# Altium schematic sheet High Current LED Driver.SchDoc: High Current Driver
size A4; SheetNumber: 3; SheetTotal: 6
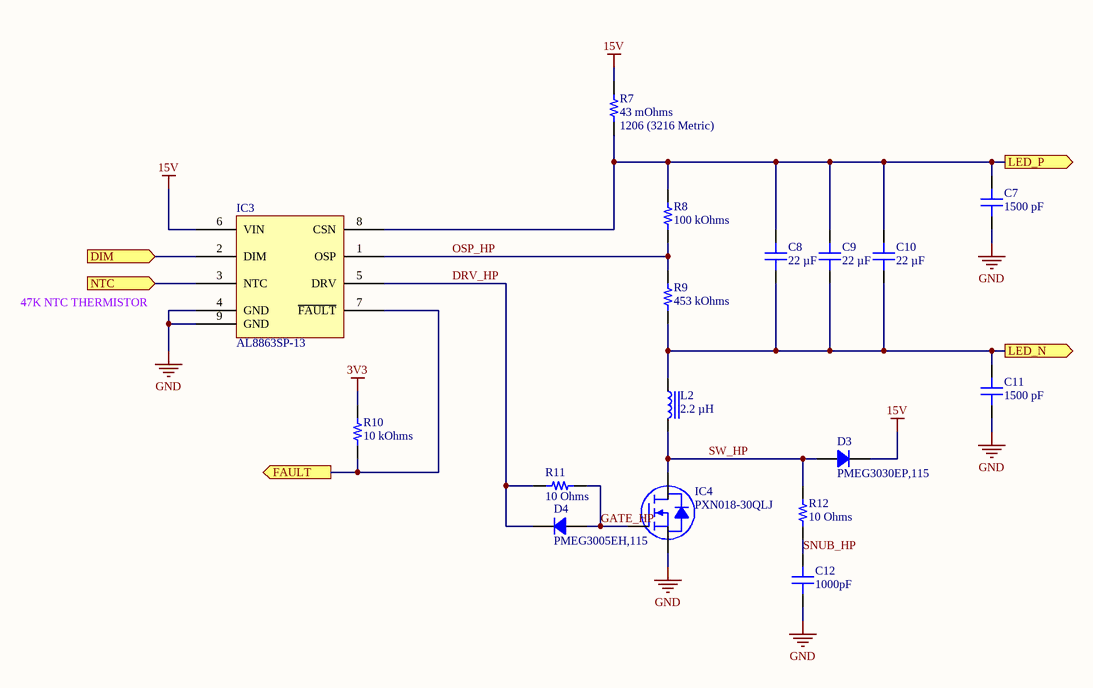
[diagram p0: High Current LED Driver.SchDoc]

## Parts
C7  1500 pF  [CAP 0603_1608]
C8  22 µF  [CAP 1210_3225 - 1MM]
C9  22 µF  [CAP 1210_3225 - 1MM]
C10  22 µF  [CAP 1210_3225 - 1MM]
C11  1500 pF  [CAP 0603_1608]
C12  1000pF  [CAP 0603_1608]
D3  PMEG3030EP,115  [NEXPERIA SOD-128 CFP5]
D4  PMEG3005EH,115  [SOD123F]
IC3  AL8863SP-13  [DIODES INC SO-8EP]
IC4  PXN018-30QLJ  [NEXPERIA MLPAK33 SOT8002-1]
L2  2.2 µH  [TAIYO YUDEN NRS8030]
R7  43 mOhms  Package / Case: 1206 (3216 Metric)  [STACKPOLE CSR1206]
R8  100 kOhms  [RES 0603_1608]
R9  453 kOhms  [RES 0603_1608]
R10  10 kOhms  [RES 0603_1608]
R11  10 Ohms  [RES 0805_2012]
R12  10 Ohms  [RES 0805_2012]

## Ports
DIM (in), FAULT (out), LED_N (out), LED_P (out), NTC (in)

## Nets
3V3: R10.2
15V: D3.2 IC3.6(VIN) R7.2
GND: C7.1 C11.1 C12.1 IC3.4(GND) IC3.9(GND) IC4.S
DIM: IC3.2(DIM) ; port DIM
DRV_HP: D4.2 IC3.5(DRV) R11.1
FAULT: IC3.7(~{FAULT}) R10.1 ; port FAULT
GATE_HP: D4.1 IC4.G R11.2
LED_N: C8.1 C9.1 C10.1 C11.2 L2.2 R9.1 ; port LED_N
LED_P: C7.2 C8.2 C9.2 C10.2 IC3.8(CSN) R7.1 R8.2 ; port LED_P
NTC: IC3.3(NTC) ; port NTC
OSP_HP: IC3.1(OSP) R8.1 R9.2
SNUB_HP: C12.2 R12.1
SW_HP: D3.1 IC4.D L2.1 R12.2

## Notes on the sheet
- 47K NTC THERMISTOR
- Title
- Size:
- Date:
- A4
- Number:
- Time:
- Revision:
- Sheet
- of
- File:

## Library data of the parts
C7 C11 = 0603N152J500CT: CAP CER 1500PF 50V C0G/NP0 0603; manufacturer: Walsin Technology Corporation; Temperature Coefficient: C0G, NP0; Tolerance: ±5%; Part Number: 0603N152J500CT; Value: 1500 pF; Applications: General Purpose; Capacitance: 1500 pF; componentlink1description: Datasheet; componentlink1url: http://www.passivecomponent.com/wp-content/uploads/2018/10/MLCC.pdf; componentlink2description: DigiKey Link; componentlink2url: https://www.digikey.com/en/products/detail/walsin-technology-corporation/0603N152J500CT/9354986; Device Package: 0603 (1608 Metric); lastupdated: 16/03/2022 06:22:23; Lifecycle Status: Active; Minimum Order: 1; Mounting Type: Surface Mount, MLCC; Operating Temperature: -55°C ~ 125°C; Package / Case: 0603 (1608 Metric); packaging: TapeAndReel; partid: 13065; Part Status: Active; price: 0.01; series: -; Size / Dimension: 0.063" L x 0.031" W (1.60mm x 0.80mm); Supplier 1: DigiKey; Supplier Part Number 1: 1292-1489-1-ND; Thickness (Max): 0.037" (0.95mm); Voltage - Rated: 50V
C8-C10 = CL32A226KAJNNNE: CAP CER 22UF 25V X5R 1210; manufacturer: Samsung Electro-Mechanics; Tolerance: ±10%; Part Number: CL32A226KAJNNNE; Value: 22 µF; Applications: General Purpose; Capacitance: 22 µF; componentlink1description: Datasheet; componentlink1url: http://www.samsungsem.com/kr/support/product-search/mlcc/CL32A226KAJNNNE.jsp; componentlink2description: DigiKey Link; componentlink2url: https://www.digikey.com/en/products/detail/samsung-electro-mechanics/CL32A226KAJNNNE/3886759; Device Package: 1210 (3225 Metric); lastupdated: 16/03/2022 06:41:57; Lifecycle Status: Active; Minimum Order: 1; Mounting Type: Surface Mount, MLCC; Operating Temperature: -55°C ~ 85°C; Package / Case: 1210 (3225 Metric); packaging: TapeAndReel; partid: 39435; Part Status: Active; price: 0.11; series: CL; Size / Dimension: 0.126" L x 0.098" W (3.20mm x 2.50mm); Supplier 1: DigiKey; Supplier Part Number 1: 1276-1101-1-ND; Temperature Coefficient: X5R; Thickness (Max): 0.106" (2.70mm); Voltage - Rated: 25V
C12 = 06035C102KAT2A: CAP CER 1000PF 50V X7R 0603; manufacturer: AVX Corporation; Tolerance: ±10%; Part Number: 06035C102KAT2A; Value: 1000pF; Applications: General Purpose; Capacitance: 1000pF; componentlink1description: Datasheet; componentlink1url: http://datasheets.avx.com/X7RDielectric.pdf; componentlink2description: DigiKey Link; componentlink2url: http://digikey.com/product-detail/en/avx-corporation/06035C102KAT2A/478-1215-1-ND/564247; Device Package: 0603 (1608 Metric); lastupdated: 02/09/2020 01:03:30; Lifecycle Status: Active; Minimum Order: 1; Mounting Type: Surface Mount, MLCC; Operating Temperature: -55°C ~ 125°C; Package / Case: 0603 (1608 Metric); packaging: TapeAndReel; partid: 5544; Part Status: Active; price: 0.01; series: -; Size / Dimension: 0.063" L x 0.032" W (1.60mm x 0.81mm); Supplier 1: DigiKey; Supplier Part Number 1: 478-1215-1-ND; Temperature Coefficient: X7R; Thickness (Max): 0.035" (0.90mm); Voltage - Rated: 50V
D3 = PMEG3030EP,115: DIODE SCHOTTKY 30V 3A CFP5; Manufacturer: Nexperia USA Inc.; Capacitance @ Vr, F: 470pF @ 1V, 1MHz; Current - Reverse Leakage @ Vr: 5 mA @ 30 V; Speed: Fast Recovery =< 500ns, > 200mA (Io); Voltage - Forward (Vf) (Max) @ If: 360 mV @ 3 A; Part Number: PMEG3030EP,115; ComponentLink1Description: Datasheet; ComponentLink1URL: https://assets.nexperia.com/documents/data-sheet/PMEG3030EP.pdf; ComponentLink2Description: DigiKey Link; ComponentLink2URL: https://www.digikey.com/en/products/detail/nexperia-usa-inc/PMEG3030EP-115/2228693; Current - Average Rectified (Io): 3A; Diode Type: Schottky; LastUpdated: 16/03/2022 11:28:51; Lifecycle Status: Active; Minimum Order: 1; Mounting Type: Surface Mount; Operating Temperature - Junction: 150°C (Max); Package / Case: SOD-128; Packaging: TapeAndReel; PartId: 3379; Part Status: Active; Price: 0.16; Series: -; Supplier 1: DigiKey; Supplier Part Number 1: 1727-5324-1-ND; Supplier Device Package: SOD-128/CFP5; Voltage - DC Reverse (Vr) (Max): 30 V
D4 = PMEG3005EH,115: DIODE SCHOTTKY 30V 500MA SOD123F; Manufacturer: Nexperia USA Inc.; Capacitance @ Vr, F: 70pF @ 1V, 1MHz; Current - Average Rectified (Io): 500mA (DC); Current - Reverse Leakage @ Vr: 150 µA @ 30 V; Speed: Fast Recovery =< 500ns, > 200mA (Io); Voltage - Forward (Vf) (Max) @ If: 430 mV @ 500 mA; Part Number: PMEG3005EH,115; ComponentLink1Description: Datasheet; ComponentLink1URL: https://assets.nexperia.com/documents/data-sheet/PMEGXX05EH_EJ_SER.pdf; ComponentLink2Description: DigiKey Link; ComponentLink2URL: https://www.digikey.com/en/products/detail/nexperia-usa-inc/PMEG3005EH-115/1157689; Diode Type: Schottky; LastUpdated: 16/03/2022 07:00:41; Lifecycle Status: Active; Minimum Order: 1; Mounting Type: Surface Mount; Operating Temperature - Junction: 150°C (Max); Package / Case: SOD-123F; Packaging: TapeAndReel; PartId: 2471; Part Status: Active; Price: 0.05; Series: -; Supplier 1: DigiKey; Supplier Part Number 1: 1727-3865-1-ND; Supplier Device Package: SOD-123F; Voltage - DC Reverse (Vr) (Max): 30 V
IC3 = AL8863SP-13: LED MV INT SWITCH SO-8EP; Manufacturer: Diodes Incorporated; Dimming: PWM; Frequency: 50kHz ~ 1MHz; Internal Switch(s): No; Number of Outputs: 1; Topology: Step-Down (Buck); Voltage - Supply (Max): 60V; Voltage - Supply (Min): 4.5V; Part Number: AL8863SP-13; Applications: Commercial & Industrial Lighting; ComponentLink1Description: Datasheet; ComponentLink1URL: https://www.diodes.com/assets/Datasheets/AL8863.pdf; ComponentLink2Description: DigiKey Link; ComponentLink2URL: https://www.digikey.com/en/products/detail/diodes-incorporated/AL8863SP-13/10481155; LastUpdated: 16/03/2022 13:00:06; Lifecycle Status: Active; Minimum Order: 1; Mounting Type: Surface Mount; Operating Temperature: -40°C ~ 125°C (TA); Package / Case: 8-SOIC (0.154", 3.90mm Width) Exposed Pad; Packaging: TapeAndReel; PartId: 9; Part Status: Active; Price: 0.23; Series: -; Supplier 1: DigiKey; Supplier Part Number 1: 31-AL8863SP-13CT-ND; Supplier Device Package: 8-SO-EP; Type: DC DC Controller
IC4 = PXN018-30QLJ: PXN018-30QL/SOT8002/MLPAK33; Manufacturer: Nexperia USA Inc.; Current - Continuous Drain (Id) @ 25°C: 7.5A (Ta), 19.2A (Tc); Drain to Source Voltage (Vdss): 30 V; Drive Voltage (Max Rds On,  Min Rds On): 4.5V, 10V; FET Type: N-Channel; Gate Charge (Qg) (Max) @ Vgs: 10.8 nC @ 10 V; Input Capacitance (Ciss) (Max) @ Vds: 447 pF @ 15 V; Power Dissipation (Max): 1.7W (Ta), 10.9W (Tc); Rds On (Max) @ Id, Vgs: 18mOhm @ 7.5A, 10V; Vgs (Max): ±20V; Vgs(th) (Max) @ Id: 2.5V @ 250µA; Part Number: PXN018-30QLJ; ComponentLink1Description: Datasheet; ComponentLink1URL: https://assets.nexperia.com/documents/data-sheet/PXN018-30QL.pdf; ComponentLink2Description: DigiKey Link; ComponentLink2URL: https://www.digikey.com/en/products/detail/nexperia-usa-inc/PXN018-30QLJ/13690066; LastUpdated: 16/03/2022 13:32:54; Lifecycle Status: Active; Minimum Order: 1; Mounting Type: Surface Mount; Operating Temperature: -55°C ~ 150°C (TJ); Packaging: TapeAndReel; Part Status: Active; Price: 0.18; Series: -; Supplier 1: DigiKey; Supplier Part Number 1: 1727-PXN018-30QLJCT-ND; Supplier Device Package: MLPAK33; Technology: MOSFET (Metal Oxide)
L2 = NRS8030T2R2NJGJ: FIXED IND 2.2UH 4.8A 19.5MOHM SM; Manufacturer: Taiyo Yuden; Current - Saturation: 4.9A; DC Resistance (DCR): 19.5mOhm Max; Frequency - Self Resonant: 60MHz; Inductance Frequency - Test: 100 kHz; Material - Core: Ferrite; Shielding: Shielded; Tolerance: ±30%; Type: Wirewound; Part Number: NRS8030T2R2NJGJ; ComponentLink1Description: Datasheet; ComponentLink1URL: https://www.yuden.co.jp/productdata/catalog/wound04_e.pdf; ComponentLink2Description: DigiKey Link; ComponentLink2URL: https://www.digikey.com/en/products/detail/taiyo-yuden/NRS8030T2R2NJGJ/2666003; Current Rating (Amps): 4.8 A; Device Package: Nonstandard; Height - Seated (Max): 0.118" (3.00mm); Inductance: 2.2 µH; LastUpdated: 16/03/2022 13:29:46; Lifecycle Status: Active; Minimum Order: 1; Mounting Type: Surface Mount; Operating Temperature: -25°C ~ 125°C; Package / Case: Nonstandard; Packaging: TapeAndReel; PartId: 5494; Part Status: Active; Price: 0.21; Series: NR, S Type; Size / Dimension: 0.315" L x 0.315" W (8.00mm x 8.00mm); Supplier 1: DigiKey; Supplier Part Number 1: 587-2965-1-ND; Value: 2.2 µH
R7 = RLP73M2BR043JTD: RES 0.043 OHM 5% 1/2W 1206; Manufacturer: TE Connectivity Passive Product; Power (Watts): 0.5W, 1/2W; Temperature Coefficient: ±400ppm/°C; Part Number: RLP73M2BR043JTD; ComponentLink1Description: Datasheet; ComponentLink1URL: https://www.te.com/commerce/DocumentDelivery/DDEController?Action=srchrtrv&DocNm=1773269&DocType=DS&DocLang=English; ComponentLink2Description: DigiKey Link; ComponentLink2URL: https://www.digikey.com/en/products/detail/te-connectivity-passive-product/RLP73M2BR043JTD/4032208; Composition: Thick Film; Device Package: 1206 (3216 Metric); Features: Current Sense; Height - Seated (Max): 0.026" (0.65mm); LastUpdated: 16/03/2022 06:57:55; Lifecycle Status: Active; Minimum Order: 1; Number of Terminations: 2; Operating Temperature: -55°C ~ 155°C; Packaging: TapeAndReel; PartId: 2125; Part Status: Active; Price: 0.10; Resistance: 43 mOhms; Series: RL73, CGS; Size / Dimension: 0.122" L x 0.061" W (3.10mm x 1.55mm); Supplier 1: DigiKey; Supplier Part Number 1: A109833CT-ND; Supplier Device Package: 1206; Tolerance: ±5%; Value: 43 mOhms
R8 = CRCW0603100KFKEAC: RES 100K OHM 1% 1/10W 0603; Manufacturer: Vishay Dale; Power (Watts): 0.1W, 1/10W; Temperature Coefficient: ±100ppm/°C; Part Number: CRCW0603100KFKEAC; Value: 100 kOhms; ComponentLink1Description: Datasheet; ComponentLink1URL: http://www.vishay.com/docs/28773/crcwce3.pdf; ComponentLink2Description: DigiKey Link; ComponentLink2URL: https://www.digikey.com/en/products/detail/vishay-dale/CRCW0603100KFKEAC/7928372; Composition: Thick Film; Device Package: 0603 (1608 Metric); Height - Seated (Max): 0.022" (0.55mm); LastUpdated: 16/03/2022 06:41:03; Lifecycle Status: Active; Minimum Order: 1; Number of Terminations: 2; Operating Temperature: -55°C ~ 155°C; Package / Case: 0603 (1608 Metric); Packaging: CutTape; PartId: 12549; Part Status: Active; Price: 0.01; Resistance: 100 kOhms; Series: CRCW-C; Supplier 1: DigiKey; Supplier Part Number 1: 541-3950-1-ND; Supplier Device Package: 0603; Tolerance: ±1%
R9 = RMCF0603FT453K: RES 453K OHM 1% 1/10W 0603; Manufacturer: Stackpole Electronics Inc; Power (Watts): 0.1W, 1/10W; Temperature Coefficient: ±100ppm/°C; Part Number: RMCF0603FT453K; Value: 453 kOhms; ComponentLink1Description: Datasheet; ComponentLink1URL: https://www.seielect.com/catalog/sei-rmcf_rmcp.pdf; ComponentLink2Description: DigiKey Link; ComponentLink2URL: https://www.digikey.com/en/products/detail/stackpole-electronics-inc/RMCF0603FT453K/1761122; Composition: Thick Film; Device Package: 0603 (1608 Metric); Features: Automotive AEC-Q200; Height - Seated (Max): 0.022" (0.55mm); LastUpdated: 16/03/2022 06:40:25; Lifecycle Status: Active; Minimum Order: 1; Number of Terminations: 2; Operating Temperature: -55°C ~ 155°C; Package / Case: 0603 (1608 Metric); Packaging: CutTape; PartId: 22558; Part Status: Active; Price: 0.01; Ratings: AEC-Q200; Resistance: 453 kOhms; Series: RMCF; Size / Dimension: 0.061" L x 0.031" W (1.55mm x 0.80mm); Supplier 1: DigiKey; Supplier Part Number 1: RMCF0603FT453KCT-ND; Supplier Device Package: 0603; Tolerance: ±1%
R10 = ERJ-3GEYJ103V: RES SMD 10K OHM 5% 1/10W 0603; Manufacturer: Panasonic Electronic Components; Power (Watts): 0.1W, 1/10W; Temperature Coefficient: ±200ppm/°C; Part Number: ERJ-3GEYJ103V; Value: 10 kOhms; ComponentLink1Description: Datasheet; ComponentLink1URL: http://industrial.panasonic.com/www-cgi/jvcr13pz.cgi?E+PZ+3+AOA0001+ERJ3GEYJ103V+7+WW; ComponentLink2Description: DigiKey Link; ComponentLink2URL: https://www.digikey.com/en/products/detail/panasonic-electronic-components/ERJ-3GEYJ103V/135662; Composition: Thick Film; Device Package: 0603 (1608 Metric); Features: Automotive AEC-Q200; Height - Seated (Max): 0.022" (0.55mm); LastUpdated: 16/03/2022 06:40:24; Lifecycle Status: Active; Minimum Order: 1; Number of Terminations: 2; Operating Temperature: -55°C ~ 155°C; Package / Case: 0603 (1608 Metric); Packaging: TapeAndReel; PartId: 22604; Part Status: Active; Price: 0.01; Ratings: AEC-Q200; Resistance: 10 kOhms; Series: ERJ-3G; Size / Dimension: 0.063" L x 0.031" W (1.60mm x 0.80mm); Supplier 1: DigiKey; Supplier Part Number 1: P10KGCT-ND; Supplier Device Package: 0603; Tolerance: ±5%
R11 R12 = CRCW080510R0JNEAC: RES 10 OHM 5% 1/8W 0805; Manufacturer: Vishay Dale; Power (Watts): 0.125W, 1/8W; Temperature Coefficient: ±200ppm/°C; Part Number: CRCW080510R0JNEAC; Value: 10 Ohms; ComponentLink1Description: Datasheet; ComponentLink1URL: http://www.vishay.com/docs/28773/crcwce3.pdf; ComponentLink2Description: DigiKey Link; ComponentLink2URL: https://www.digikey.com/en/products/detail/vishay-dale/CRCW080510R0JNEAC/7928589; Composition: Thick Film; Device Package: 0805 (2012 Metric); Height - Seated (Max): 0.024" (0.60mm); LastUpdated: 16/03/2022 06:53:04; Lifecycle Status: Active; Minimum Order: 1; Number of Terminations: 2; Operating Temperature: -55°C ~ 155°C; Package / Case: 0805 (2012 Metric); Packaging: TapeAndReel; PartId: 37142; Part Status: Active; Price: 0.01; Resistance: 10 Ohms; Series: CRCW-C; Size / Dimension: 0.079" L x 0.049" W (2.00mm x 1.25mm); Supplier 1: DigiKey; Supplier Part Number 1: 541-4167-1-ND; Supplier Device Package: 0805; Tolerance: ±5%